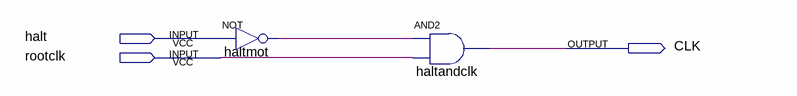
[diagram p0: schematic sheet]
// Quartus schematic halt.bdf as structural Verilog: 2 symbols, 3 pins
module halt (
  input  halt,
  input  rootclk,
  output CLK
);

  wire haltmot_out;

  not haltmot (haltmot_out, halt);
  and haltandclk (CLK, haltmot_out, rootclk);
endmodule
